# Altium schematic sheet wacky-hat.SchDoc: Wacky Hat
size A3; DrawnBy: HM, WG, TC, SC; Address1: ECE Department; Address2: University of Canterbury; Address3: Christchurch 8041; Address4: New Zealand; Revision: 1; ImagePath: \\maxwell\elecapp\AltiumDesigner\Templates\uc-logo.png
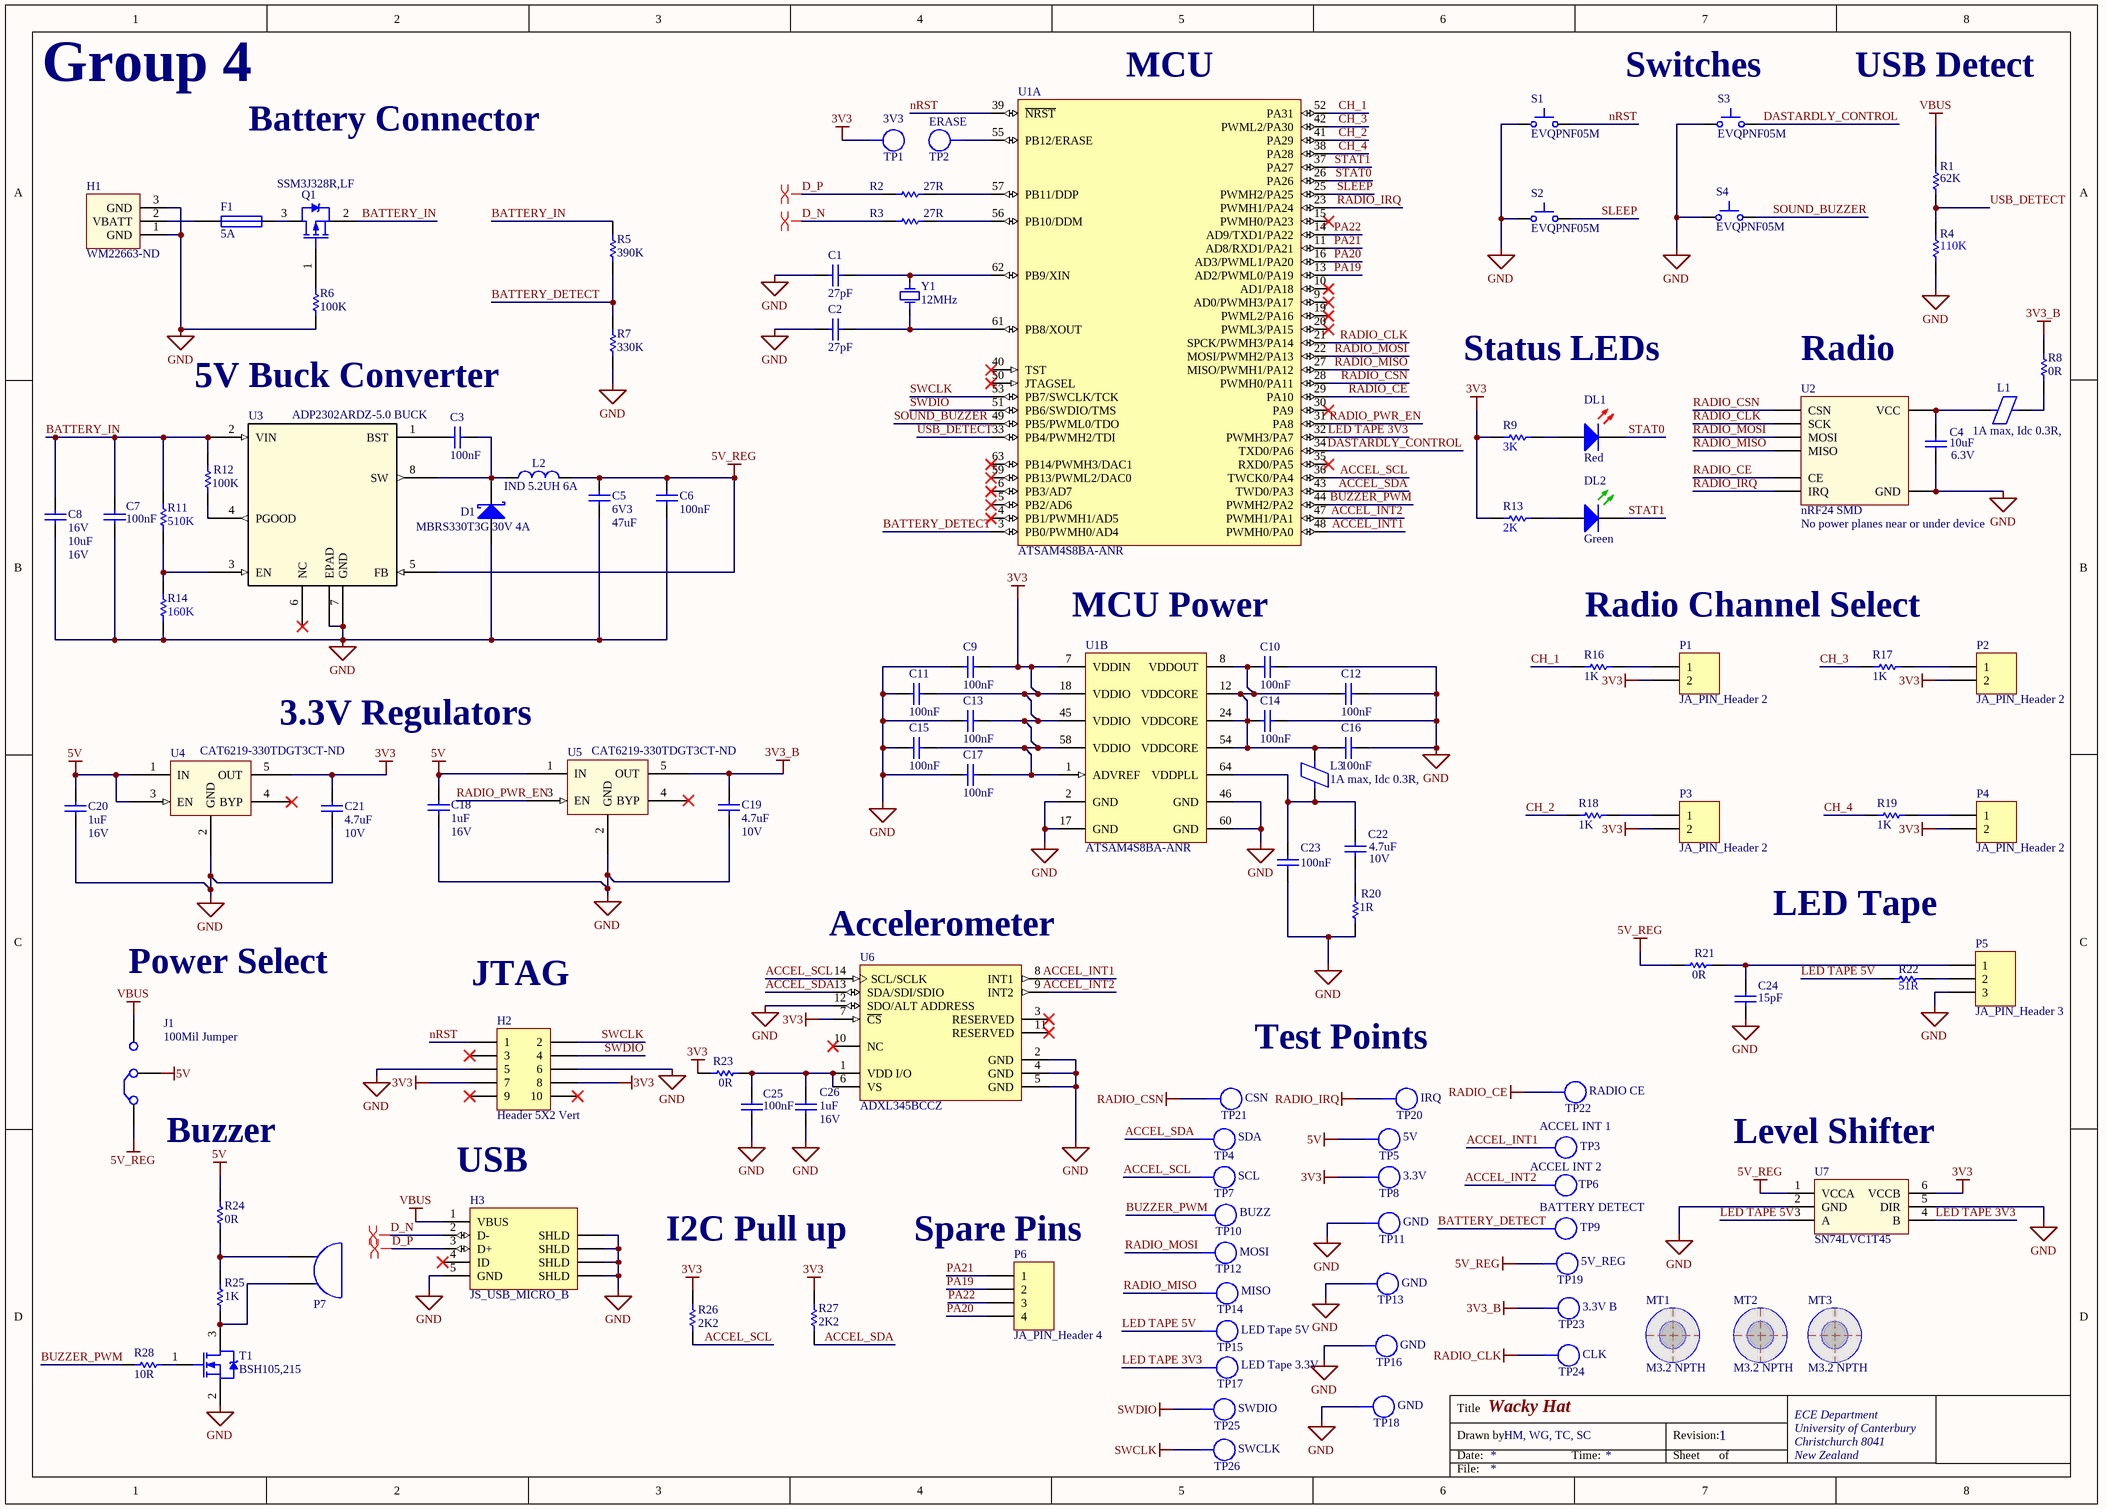
[diagram p0: wacky-hat.SchDoc]

## Parts
C1  27pF  [CAPC1608L]
C2  27pF  [CAPC1608L]
C3  100nF  [CAPC1608L]
C4  Voltage - Rated: 6.3V  [CAPC1608L]  (hidden comment: 10uF)
C5  Voltage Rating: 6V3  Capacitance: 47uF  [CAPC2012N]  (hidden comment: CC_47uF_0805_6V3)
C6  100nF  [CAPC1608L]
C7  100nF  [CAPC1608L]
C8  Voltage - Rated: 16V  [CAPC2012L]  (hidden comment: 10uF)
C9  100nF  [CAPC1608L]
C10  100nF  [CAPC1608L]
C11  100nF  [CAPC1608L]
C12  100nF  [CAPC1608L]
C13  100nF  [CAPC1608L]
C14  100nF  [CAPC1608L]
C15  100nF  [CAPC1608L]
C16  100nF  [CAPC1608L]
C17  100nF  [CAPC1608L]
C18  Max Voltage: 16V  [CAPC1608L]  (hidden comment: 1uF)
C19  Max Voltage: 10V  [CAPC1608N]  (hidden comment: 4.7uF)
C20  Max Voltage: 16V  [CAPC1608L]  (hidden comment: 1uF)
C21  Max Voltage: 10V  [CAPC1608N]  (hidden comment: 4.7uF)
C22  Max Voltage: 10V  [CAPC1608N]  (hidden comment: 4.7uF)
C23  100nF  [CAPC1608L]
C24  15pF  [CAPC1608L]
C25  100nF  [CAPC1608L]
C26  Max Voltage: 16V  [CAPC1608L]  (hidden comment: 1uF)
D1  MBRS330T3G 30V 4A  [SMC]
DL1  Red  [WL-SMCW0603]
DL2  Green  [WL-SMCW0603]
F1  5A  [RESC3216N]
H1  Supplier Part Number 1: WM22663-ND  [BATT_HEADER_3POS]  (hidden comment: Battery_HEADER_3pin)
H2  Header 5X2 Vert  [IDC2.54-V10D]
H3  JS_USB_MICRO_B  [FCI_USB_10118194-0001LF]
J1  100Mil Jumper  [JMP2.54-CO]
L1  1A max, Idc 0.3R,  [INDC3216L]
L2  IND 5.2UH 6A  [INDUCTOR5u2]
L3  1A max, Idc 0.3R,  [INDC3216L]
MT1  M3.2 NPTH  [MNT-HOLE_3.2mm_NPTH]  (no BOM)
MT2  M3.2 NPTH  [MNT-HOLE_3.2mm_NPTH]  (no BOM)
MT3  M3.2 NPTH  [MNT-HOLE_3.2mm_NPTH]  (no BOM)
P1  JA_PIN_Header 2  [HDR1X2]
P2  JA_PIN_Header 2  [HDR1X2]
P3  JA_PIN_Header 2  [HDR1X2]
P4  JA_PIN_Header 2  [HDR1X2]
P5  JA_PIN_Header 3  [HDR1X3]
P6  JA_PIN_Header 4  [HDR1X4]
P7  Piezo Buzzer  [BUZZER]  (value not drawn)
Q1  SSM3J328R,LF  [SOT23_L]
R1  62K  [RESC1608L]
R2  27R  [RESC1608L]
R3  27R  [RESC1608L]
R4  110K  [RESC1608L]
R5  390K  [RESC1608L]
R6  100K  [RESC1608L]
R7  330K  [RESC1608L]
R8  0R  [RESC1608L]
R9  3K  [RESC1608L]
R11  510K  [RESC1608L]
R12  100K  [RESC1608L]
R13  2K  [RESC1608L]
R14  160K  [RESC1608L]
R16  1K  [RESC1608L]
R17  1K  [RESC1608L]
R18  1K  [RESC1608L]
R19  1K  [RESC1608L]
R20  1R  [RESC3216L]
R21  0R  [RESC1608L]
R22  51R  [RESC1608L]
R23  0R  [RESC1608L]
R24  0R  [RESC1608L]
R25  1K  [RESC1608L]
R26  2K2  [RESC1608L]
R27  2K2  [RESC1608L]
R28  10R  [RESC1608L]
S1  EVQPNF05M  [EVQPNF05M]
S2  EVQPNF05M  [EVQPNF05M]
S3  EVQPNF05M  [EVQPNF05M]
S4  EVQPNF05M  [EVQPNF05M]
T1  BSH105,215  [SOT23_L]
TP1  3V3  [TP_1206]  (no BOM)
TP2  ERASE  [TP_1206]  (no BOM)
TP3  ACCEL INT 1  [TP_1206]  (no BOM)
TP4  SDA  [TP_1206]  (no BOM)
TP5  5V  [TP_1206]  (no BOM)
TP6  ACCEL INT 2  [TP_1206]  (no BOM)
TP7  SCL  [TP_1206]  (no BOM)
TP8  3.3V  [TP_1206]  (no BOM)
TP9  BATTERY DETECT  [TP_1206]  (no BOM)
TP10  BUZZ  [TP_1206]  (no BOM)
TP11  GND  [TP_1206]  (no BOM)
TP12  MOSI  [TP_1206]  (no BOM)
TP13  GND  [TP_1206]  (no BOM)
TP14  MISO  [TP_1206]  (no BOM)
TP15  LED Tape 5V  [TP_1206]  (no BOM)
TP16  GND  [TP_1206]  (no BOM)
TP17  LED Tape 3.3V  [TP_1206]  (no BOM)
TP18  GND  [TP_1206]  (no BOM)
TP19  5V_REG  [TP_1206]  (no BOM)
TP20  IRQ  [TP_1206]  (no BOM)
TP21  CSN  [TP_1206]  (no BOM)
TP22  RADIO CE  [TP_1206]  (no BOM)
TP23  3.3V B  [TP_1206]  (no BOM)
TP24  CLK  [TP_1206]  (no BOM)
TP25  SWDIO  [TP_1206]  (no BOM)
TP26  SWCLK  [TP_1206]  (no BOM)
U1  ATSAM4S8BA-ANR  [LQFP64_L]  (parts A,B of 2)
U2  nRF24 SMD  Warning: No power planes near or under device  [NRF24]
U3  ADP2302ARDZ-5.0 BUCK  [RD_8_1]
U4  Supplier Part Number: CAT6219-330TDGT3CT-ND  [SOT95P280X145-5N]  (hidden comment: CAT6219-330TDGT3)
U5  Supplier Part Number: CAT6219-330TDGT3CT-ND  [SOT95P280X145-5N]  (hidden comment: CAT6219-330TDGT3)
U6  ADXL345BCCZ  [ADI-CC-14-1_V]
U7  SN74LVC1T45  [SOT23-6_N]
Y1  12MHz  [6.0X3.5-4]

## Nets
3V3: C9.2 C11.2 C13.2 C15.2 C17.2 C21.2 H2.7 H2.8 P1.2 P2.2 P3.2 P4.2 R9.1 R13.1 R23.1 R26.2 R27.2 TP1.1 TP8.1 U1.1(ADVREF) U1.7(VDDIN) U1.18(VDDIO) U1.45(VDDIO) U1.58(VDDIO) U4.5(OUT) U6.7(~{CS}) U7.6(VCCB)
3V3_B: C19.2 R8.2 TP23.1 U5.5(OUT)
5V: C18.2 C20.2 J1.2(C2) R24.2 TP5.1 U4.1(IN) U4.3(EN) U5.1(IN)
5V_REG: C5.2 C6.2 J1.1(C1) L2.2 R21.1 TP19.1 U3.5(FB) U7.1(VCCA)
GND: C1.1 C2.1 C4.1 C5.1 C6.1 C7.1 C8.1 C9.1 C10.1 C11.1 C12.1 C13.1 C14.1 C15.1 C16.1 C17.1 C18.1 C19.1 C20.1 C21.1 C23.1 C24.1 C25.1 C26.1 D1.1(A) H1.1(GND) H1.3(GND) H2.5 H2.6 H3.5(GND) H3.6(SHLD) P5.3 R4.1 R6.1 R7.1 R14.1 R20.1 S1.1 S2.1 S3.1 S4.1 T1.2 TP11.1 TP13.1 TP16.1 TP18.1 U1.2(GND) U1.17(GND) U1.46(GND) U1.60(GND) U2.2(GND) U3.7(GND) U3.EPAD U4.2(GND) U5.2(GND) U6.2(GND) U6.4(GND) U6.5(GND) U6.12(SDO/ALT_ADDRESS) U7.2(GND) U7.5(DIR)
RADIO_CE: TP22.1 U1.29(PA10) U2.3(CE)
RADIO_CLK: TP24.1 U1.21(SPCK/PWMH3/PA14) U2.5(SCK)
RADIO_CSN: TP21.1 U1.28(PWMH0/PA11) U2.4(CSN)
RADIO_IRQ: TP20.1 U1.23(PWMH1/PA24) U2.8(IRQ)
SWCLK: H2.2 TP26.1 U1.53(PB7/SWCLK/TCK)
SWDIO: H2.4 TP25.1 U1.51(PB6/SWDIO/TMS)
VBUS: H3.1(VBUS) J1.3(C3) R1.2
ACCEL_INT1: TP3.1 U1.48(PWMH0/PA0) U6.8(INT1)
ACCEL_INT2: TP6.1 U1.47(PWMH1/PA1) U6.9(INT2)
ACCEL_SCL: R26.1 TP7.1 U1.36(TWCK0/PA4) U6.14(SCL/SCLK)
ACCEL_SDA: R27.1 TP4.1 U1.43(TWD0/PA3) U6.13(SDA/SDI/SDIO)
BATTERY_DETECT: R5.1 R7.2 TP9.1 U1.3(PB0/PWMH0/AD4)
BATTERY_IN: C7.2 C8.2 Q1.2 R5.2 R11.2 R12.2 U3.2(VIN)
BUZZER_PWM: R28.1 TP10.1 U1.44(PWMH2/PA2)
CH_1: R16.1 U1.52(PA31)
CH_2: R18.1 U1.41(PA29)
CH_3: R17.1 U1.42(PWML2/PA30)
CH_4: R19.1 U1.38(PA28)
D_N: H3.2(D-) R3.1
D_P: H3.3(D+) R2.1
DASTARDLY_CONTROL: S3.2 U1.34(TXD0/PA6)
LED TAPE 3V3: TP17.1 U1.32(PWMH3/PA7) U7.4(B)
LED TAPE 5V: R22.1 TP15.1 U7.3(A)
nRST: H2.1 S1.2 U1.39(~{NRST})
PA19: P6.2 U1.13(AD2/PWML0/PA19)
PA20: P6.4 U1.16(AD3/PWML1/PA20)
PA21: P6.1 U1.11(AD8/RXD1/PA21)
PA22: P6.3 U1.14(AD9/TXD1/PA22)
RADIO_MISO: TP14.1 U1.27(MISO/PWMH1/PA12) U2.7(MISO)
RADIO_MOSI: TP12.1 U1.22(MOSI/PWMH2/PA13) U2.6(MOSI)
RADIO_PWR_EN: U1.31(PA8) U5.3(EN)
SLEEP: S2.2 U1.25(PWMH2/PA25)
SOUND_BUZZER: S4.2 U1.49(PB5/PWML0/TDO)
STAT0: DL1.1(K) U1.26(PA26)
STAT1: DL2.1(K) U1.37(PA27)
USB_DETECT: R1.1 R4.2 U1.33(PB4/PWMH2/TDI)
NetC1_2: C1.2 U1.62(PB9/XIN) Y1.3(OSC2)
NetC2_2: C2.2 U1.61(PB8/XOUT) Y1.1(OSC1)
NetC3_1: C3.1 U3.1(BST)
NetC3_2: C3.2 D1.2(K) L2.1 U3.8(SW)
NetC4_2: C4.2 L1.1 U2.1(VCC)
NetC10_2: C10.2 C12.2 C14.2 C16.2 L3.2 U1.8(VDDOUT) U1.12(VDDCORE) U1.24(VDDCORE) U1.54(VDDCORE)
NetC22_1: C22.1 C23.2 L3.1 U1.64(VDDPLL)
NetC22_2: C22.2 R20.2
NetC24_2: C24.2 P5.1 R21.2
NetC25_2: C25.2 C26.2 R23.2 U6.1(VDD_I/O) U6.6(VS)
NetDL1_2: DL1.2(A) R9.2
NetDL2_2: DL2.2(A) R13.2
NetF1_1: F1.1 H1.2(VBATT)
NetF1_2: F1.2 Q1.3
NetL1_2: L1.2 R8.1
NetP1_1: P1.1 R16.2
NetP2_1: P2.1 R17.2
NetP3_1: P3.1 R18.2
NetP4_1: P4.1 R19.2
NetP5_2: P5.2 R22.2
NetP7_1: P7.1 R24.1 R25.2
NetP7_2: P7.2 R25.1 T1.3
NetQ1_1: Q1.1 R6.2
NetR2_2: R2.2 U1.57(PB11/DDP)
NetR3_2: R3.2 U1.56(PB10/DDM)
NetR11_1: R11.1 R14.2 U3.3(EN)
NetR12_1: R12.1 U3.4(PGOOD)
NetR28_2: R28.2 T1.1
NetTP2_1: TP2.1 U1.55(PB12/ERASE)

Not connected (* = marked no-connect by the designer): H2 3* 9* 10*; H3 4(ID)*; U1 4(PB1/PWMH1/AD5)* 5(PB2/AD6)* 6(PB3/AD7)* 9(AD0/PWMH3/PA17)* 10(AD1/PA18)* 15(PWMH0/PA23)* 19(PWML2/PA16)* 20(PWML3/PA15)* 30(PA9)* 35(RXD0/PA5)* 40(TST)* 50(JTAGSEL)* 59(PB13/PWML2/DAC0)* 63(PB14/PWMH3/DAC1)*; U3 6(NC)*; U4 4(BYP)*; U5 4(BYP)*; U6 3(RESERVED)* 10(NC)* 11(RESERVED)*

## Layout directives
differential pair; differential pair class D_N: D_N
differential pair; differential pair class D_P: D_P

## Notes on the sheet
- Group 4
- (near U1) MCU
- (near S3) Switches
- USB Detect
- Battery Connector
- Status LEDs
- (near U2) Radio
- 5V Buck Converter
- MCU Power
- Radio Channel Select
- 3.3V Regulators
- LED Tape
- (near J1) Power Select
- (near H2) JTAG
- (near U6) Accelerometer
- Test Points
- (near J1) Buzzer
- USB
- (near U7) Level Shifter
- I2C Pull up
- (near P6) Spare Pins
- Title
- Drawn by:
- Date:
- Time:
- Revision:
- Sheet
- of
- File:

## Library data of the parts
C1 C2 = CC_27pF_0603: CAP CER 27pF NPO/COG +-5% 50V 0603; PackageReference: 0603; Code_IPC: 1608 [0603]; Verify: *; Supplier: ECE Dept; Storage Location: PCB Assembly WS; Value: 27pF
C3 C6 C7 C9-C17 C23 C25 = CC_100nF_0603: CAP CER 100nF X7R +-10% 50V 0603; PackageReference: 0603; Code_IPC: 1608 [0603]; Verify: *; Supplier: ECE Dept; Storage Location: PCB Assembly WS; Value: 100nF
C4 = CC_10uF_0603: CAP CER 10UF X5R +-20% 6V3 0603; Supplier: ECE Dept; Storage Location: PCB Assembly WS; Value: 10uF
C5 = CC_47uF_0805_6V3: SAMSUNG ELECTRO-MECHANICS - CL21A476MQCLRNC - CAP, 47UF, 6.3V, MLCC, 0805; Tolerance: 20%; Dielectric: X5R; Supplier 1: Digi-Key; Manufacturer 1: Samsung; Manufacturer Part Number 1: CL21A476MQCLRNC; Stock 1: 94580; Pricing 1: 1=0.56000, 10=0.39100, 50=0.27380, 100=0.23470, 500=0.17602, 1000=0.14865 (USD); RoHS: Yes; Mount: Surface Mount; Case/Package: 0805; Case Code (Metric): 2012; Case Code (Imperial): 0805; Contact Plating: Tin; Min Operating Temperature: -55°C; Max Operating Temperature: 85°C; Packaging: Tape and Reel; Package Quantity: 4000; Termination: Wraparound; Series: CL; Construction: Flat; Length: 2mm; Width: 0.049inch; Thickness: 0.037inch; Depth: 1.25mm; Lead Free: Lead Free; RoHS Compliant: Yes; ComponentLink1URL: https://datasheet.ciiva.com/25723/cl21a476mqclrnc-25723991.pdf?src-supplier=Digi-Key; ComponentLink1Description: https://datasheet.ciiva.com/25723/cl21a476mqclrnc-25723991.pdf?src-supplier=Digi-Key; Supplier Part Number 1: 1276-2420-1-ND
C8 = CC_10uF_0805_16V: CAP CER 10uF X5R 16V 0805; Manufacturer: Samsung Electro-Mechanics; Manufacturer Part Number: CL21A106KOQNNWE; Note: Footprint corresponds to dimensions for bulk cassette packaging. This case size has tightened tolerances.; Tolerance: ±10%; Notification: Current market demand for these product types have resulted in fluctuating and extending lead times. Lead times may differ.; PackageReference: 0805; Code_IPC: 2012[0805]; Supplier 1: Digi-Key; RoHS: RoHS Compliant; Category: Capacitors; Stock 1: 20000; Pricing 1: 1=0.35, 10=0.25, 100=0.1178, 500=0.08254, 1000=0.06831 (NZD); Packaging: Cut Tape (CT); Part Status: Active; Temperature Coefficient: X5R; Operating Temperature: -55°C ~ 85°C; Features: -; Ratings: -; Applications: General Purpose; Mounting Type: Surface Mount, MLCC; Package / Case: 0805 (2012 Metric); Size / Dimension: 0.079" L x 0.049" W (2.00mm x 1.25mm); Height - Seated (Max): -; Thickness (Max): 0.055" (1.40mm); Lead Spacing: -; Lead Style: -; ComponentLink1URL: http://www.samsungsem.com/kr/support/product-search/mlcc/CL21A106KOQNNWE.jsp; ComponentLink1Description: http://www.samsungsem.com/kr/support/product-search/mlcc/CL21A106KOQNNWE.jsp; Supplier Part Number 1: 1276-2894-1-ND; Value: 10uF; Max Voltage: 16V
C18 C20 C26 = CC_1uF_0603: CAP CER 1uF Y5V -20% +80% 16V 0603; PackageReference: 0603; Code_IPC: 1608 [0603]; Verify: *; Supplier: ECE Dept; Storage Location: PCB Assembly WS; Value: 1uF
C19 C21 C22 = CC_4.7uF_0603: CAP CER 4.7uF X5R +-20%  10V 0603; Note: Footprint corresponds to dimensions for bulk cassette packaging. This case size has tightened tolerances.; PackageReference: 0805; Code_IPC: 2012[0805]; Verify: *; Supplier: ECE Dept; Storage Location: PCB Assembly WS; Value: 4.7uF
C24 = CC_15pF_0603: CAP CER 15pF NPO/COG +-5% 50V 0603; PackageReference: 0603; Code_IPC: 1608 [0603]; Verify: *; Supplier: ECE Dept; Storage Location: PCB Assembly WS; Value: 15pF
D1 = MBRS330T3G: SCHOTTKY  30V 4A; Manufacturer: ON Semiconductor; Speed: Fast Recovery =< 500ns, > 200mA (Io); Supplier 1: Digi-Key; Manufacturer Part Number: MBRS330T3G; RoHS: RoHS Compliant; Category: Discrete Semiconductor Products; Stock 1: 8919; Pricing 1: 1=0.93, 10=0.79, 100=0.5902, 500=0.46368, 1000=0.35829 (NZD); Packaging: Cut Tape (CT); Part Status: Active; Diode Type: Schottky; Current - Average Rectified (Io): 4A; Capacitance @ Vr, F: -; Mounting Type: Surface Mount; Package / Case: DO-214AB, SMC; Supplier Device Package: SMC; Operating Temperature - Junction: -65°C ~ 150°C; Base Part Number: MBRS330; ComponentLink1URL: http://www.onsemi.com/pub/Collateral/MBRS340T3-D.PDF; ComponentLink1Description: http://www.onsemi.com/pub/Collateral/MBRS340T3-D.PDF; Supplier Part Number 1: MBRS330T3GOSCT-ND
DL1 = DL_150060RS75000: LED Red 250mcd 0603 SMD; Manufacturer: WURTH ELEKTRONIK; Forward Current If: 30; Forward Voltage: 2; Lens Shape: Rectangular; Luminous Intensity: 250; Wavelength Typ: 625; Viewing Angle: 140°; LED Mounting: SMD; Supplier 1: Farnell; Supplier Part Number 1: 2322071; Manufacturer Part Number: 150060RS75000; Storage Location: PCB Assembly WS; Supplier: ECE Dept; LED Colour: Red
DL2 = DL_150060GS75000: LED Green 430mcd 0603 SMD; Manufacturer: WURTH ELEKTRONIK; Forward Current If: 30; Wavelength Typ: 520; Forward Voltage: 3.2; Lens Shape: Rectangular; Luminous Intensity: 430; Viewing Angle: 140°; LED Mounting: SMD; Supplier 1: Farnell; Supplier Part Number 1: 2322070; Manufacturer Part Number: 150060GS75000; Storage Location: PCB Assembly WS; Supplier: ECE Dept; LED Colour: Green
F1 = FS_Fuse_5.0A: Fuse 5.0A Fast Acting 1206 SMD; Manufacturer Part Number: C1F5; Manufacturer: Bel TRP; Voltage Rating (AC): 125V; Voltage Rating (DC): 63V; DC Cold Resistance: 19mR; Fuse Type: Board Mount (Cartridge Style Excluded); Approvals: CE,cURus; Mount: Surface Mount; Case/Package: 1206; Number of Pins: 2; Case Code (Metric): 3216; Case Code (Imperial): 1206; Contact Plating: Nickel,Tin; Min Operating Temperature: -55°C; Max Operating Temperature: 125°C; Packaging: Tape and Reel; Voltage Rating: 125V; Length: 0.126inch; Width: 0.062inch; Supplier 1: Digi-Key; Stock 1: 725; Pricing 1: 1=0.32, 5=0.312, 10=0.298, 50=0.2662, 100=0.2479, 250=0.22032, 500=0.1836, 1000=0.17442 (USD); ComponentLink1URL: http://www.farnell.com/datasheets/2571625.pdf; ComponentLink1Description: http://www.farnell.com/datasheets/2571625.pdf; ComponentLink2URL: http://belfuse.com/pdfs/C1F.pdf; ComponentLink2Description: http://belfuse.com/pdfs/C1F.pdf; ComponentLink3URL: http://www.mouser.com/ds/2/643/C1F-594910.pdf; ComponentLink3Description: http://www.mouser.com/ds/2/643/C1F-594910.pdf; ComponentLink4URL: https://belfuse.com/resources/StewartConnector/C1F.pdf; ComponentLink4Description: https://belfuse.com/resources/StewartConnector/C1F.pdf; Current Rating: 5A; Supplier Part Number 1: 507-1886-1-ND; Supplier 2: Element14; Supplier Part Number 2: 2848595; Value: 5A
H1 = Battery_HEADER_3pin: 3Pin Header 2.54mm spacing / Digikey #WM22663-ND; Supplier 1: Digi-Key
H2 = JA_HDR_IDC_5X2_VERT: IDC Header, 2,54mm, 10-Pin, Vert; Supplier: ECE Dept; Supplier 1: Farnell; Supplier Part Number 1: 1096985; Storage Location: ECE Dept Store
H3 = JS_USB_MICRO_B_SMT: CONN USB MICRO B RECPT SMT R/A; Manufacturer: FCI; Manufacturer Part Number: 10118194-0001LF; Gender: Receptacle; Number of Contacts: 5; Specifications: USB 2.0; Supplier 1: Digi-Key; Supplier Part Number 1: 609-4618-1-ND; Features: Shielded, Solder Retention; Mounting Type: Surface Mount, Right Angle, Horizontal
J1 = TP_JUMPER_CO: 2.54mm Jumper change over, Thru Hole; Supplier: ECE Dept; Storage Location: ECE$ Store
L1 L3 = IN_Ferrite-Bead: Ferrite Bead, Rdc 0.3R, Z100MHZ 600R, Imax 1A, SMD 1206; Manufacturer: FAIR-RITE; Manufacturer PN: 2512066017Y1; DC Current Rating: 1; DC Resistance Max: 0.08; Ferrite Case Style: 1206 ^3216 Metric]; Frequency Range: 50MHz to 1; Impedance: 600; Impedance Tolerance: ± 25%; Supplier: ECE Dept; Storage Location: PCB Assembly WS; Ferrite Mounting: SMD; Supplier 1: Farnell; Supplier Part Number 1: 1612060; Manufacturer Part Number: 2512066017Y1; Value: 1A max, Idc 0.3R,
L2 = CDRH104RNP-5R2NC: FIXED IND 5.2UH 6A 22 MOHM SMD; Manufacturer: Sumida America Components Inc.; Material - Core: Ferrite; Tolerance: ±30%; Current - Saturation: 5.6A; Shielding: Shielded; DC Resistance (DCR): 22 mOhm Max; Supplier 1: Digi-Key; Manufacturer Part Number: CDRH104RNP-5R2NC; RoHS: RoHS Compliant; Category: Inductors, Coils, Chokes; Stock 1: 3849; Pricing 1: 1=2.9, 10=2.678, 100=1.8743, 500=1.5173 (NZD); Packaging: Cut Tape (CT); Part Status: Active; Type: -; Q @ Freq: -; Frequency - Self Resonant: -; Ratings: -; Operating Temperature: -40°C ~ 100°C; Mounting Type: Surface Mount; Package / Case: Nonstandard; Supplier Device Package: -; Size / Dimension: 0.402" L x 0.394" W (10.20mm x 10.00mm); Height - Seated (Max): 0.157" (4.00mm); ComponentLink1URL: http://products.sumida.com/products/pdf/CDRH104R.pdf; ComponentLink1Description: http://products.sumida.com/products/pdf/CDRH104R.pdf; Supplier Part Number 1: 308-2280-1-ND
MT1-MT3 = MC_M3.2_HOLE: Fixing M3.2 Mount Hole NPTH; Manufacturer: Hi-Q; Manufacturer PN: 3BV series M3 Clearance; price: 0; Supplier: ECE Dept; value: M3.2 NPTH
P1-P4 = JA_PIN_Header 2: Header, 2-Pin; LatestRevisionDate: 17-Jul-2002; LatestRevisionNote: Re-released for DXP Platform.; Publisher: Altium Limited
P5 = JA_PIN_Header 3: Header, 3-Pin; LatestRevisionDate: 17-Jul-2002; LatestRevisionNote: Re-released for DXP Platform.; Publisher: Altium Limited
P6 = JA_PIN_Header 4: Header, 4-Pin; LatestRevisionDate: 17-Jul-2002; LatestRevisionNote: Re-released for DXP Platform.; Publisher: Altium Limited
P7 = Piezo Buzzer: TDK - PS1240P02BT - BUZZER, PIEZO, 70DB, 12.2MM; Number of Terminals/Pins: 2; Frequency: 4kHz; Operating Supply Voltage: 3V; Washable: No; Supplier 1: Digi-Key; Manufacturer 1: TDK; Manufacturer Part Number 1: PS1240P02BT; Stock 1: 24025; Pricing 1: 1=0.61000, 10=0.52500, 25=0.49120, 50=0.46580, 100=0.44110 (USD); RoHS: Yes; Mount: Through Hole; Number of Pins: 2; Min Operating Temperature: -10°C; Max Operating Temperature: 70°C; Package Quantity: 1; Packaging: Tape and Reel; Termination: PC Pins; Voltage Rating (DC): 3V; Series: PS; Diameter: 12.2mm; Height: 6.5mm; Lead Free: Lead Free; RoHS Compliant: Yes; ComponentLink1URL: https://datasheet.ciiva.com/0/ef532-ps-112.pdf?src-supplier=Digi-Key; ComponentLink1Description: https://datasheet.ciiva.com/0/ef532-ps-112.pdf?src-supplier=Digi-Key; ComponentLink2URL: https://datasheet.ciiva.com/0/ef532-ps-111.pdf?src-supplier=Digi-Key; ComponentLink2Description: https://datasheet.ciiva.com/0/ef532-ps-111.pdf?src-supplier=Digi-Key; ComponentLink3URL: https://datasheet.ciiva.com/3306/ef532-ps-3306958.pdf?src-supplier=Avnet; ComponentLink3Description: https://datasheet.ciiva.com/3306/ef532-ps-3306958.pdf?src-supplier=Avnet; ComponentLink4URL: https://datasheet.ciiva.com/16225/ef532-ps-16225062.pdf?src-supplier=Onlinecomponents.com; ComponentLink4Description: https://datasheet.ciiva.com/16225/ef532-ps-16225062.pdf?src-supplier=Onlinecomponents.com; Supplier Part Number 1: 445-2525-1-ND
Q1 = TM_SSM3J328R: MOSFET P-CH 20V 6A SOT23-3; Manufacturer: Toshiba; FET Feature: Logic Level Gate, 1.5V Drive; FET Type: MOSFET P-Channel, Metal Oxide; Gate Charge (Qg) @ Vgs: 12.8nC @ 4.5V; Input Capacitance (Ciss) @ Vds: 840pF @ 10V; Power - Max: 1W; Rds On Max: 29.8mR; Drain to Source Resistance: 47.4mR; Turn-On Delay Time: 32ns; Power Dissipation: 2W; Number of Channels: 1; Turn-Off Delay Time: 107ns; Gate to Source Voltage (Vgs): 8V; Input Capacitance: 840pF; Element Configuration: Single; Drain to Source Breakdown Voltage: -20V; Vgs(th) (Max) @ Id: 1V @ 1mA; Current - Continuous Drain (Id) @ 25° C: 6A; Drain to Source Voltage (Vdss): 20V; Package / Case: SOT-23-3 Flat Leads; Supplier Device Package: SOT-23F; Pricing: 1=0.79, 10=0.658, 25=0.5772, 100=0.4939, 250=0.42836, 500=0.36284, 1000=0.27972 (NZD); Storage Location: PCB Assembly WS; Supplier: Digi-Key; ComponentLink1URL: https://datasheet.ciiva.com/11158/ssm3j328r-datasheet-en-20140301-11158652.pdf; ComponentLink1Description: https://datasheet.ciiva.com/11158/ssm3j328r-datasheet-en-20140301-11158652.pdf; Supplier Part Number: SSM3J328RLFDKR-ND; Max Operating Temperature: 150°C; Mount: Surface Mount; Packaging: Tape and Reel; Min Operating Temperature: -55°C; Continuous Drain Current (ID): 6A; Radiation Hardening: No; Max Power Dissipation: 1W; Package Quantity: 3000; Case/Package: SOT-23-3; Number of Pins: 3; Number of Elements: 1; Supplier 1: Digi-Key; Supplier Part Number 1: SSM3J328RLFDKR-ND; Manufacturer Part Number: SSM3J328R,LF
R1 = RS_62K: RES 62.0K OHM 1/10W 5% 0603 SMD; Storage Location: PCB Assembly WS; Supplier: ECE Dept; Value: 62K
R2 R3 = RS_27R: RES 27 OHM 1/10W 5% 0603 SMD; Storage Location: PCB Assembly WS; Supplier: ECE Dept; Value: 27R
R4 = RS_110K: RES 110K OHM 1/10W 5% 0603 SMD; Storage Location: PCB Assembly WS; Supplier: ECE Dept; Value: 110K
R5 = RS_390K: RES 390K OHM 1/10W 5% 0603 SMD; Storage Location: PCB Assembly WS; Supplier: ECE Dept; Value: 390K
R6 R12 = RS_100K: RES 100K OHM 1/10W 5% 0603 SMD; Storage Location: PCB Assembly WS; Supplier: ECE Dept; Value: 100K
R7 = RS_330K: RES 330K OHM 1/10W 5% 0603 SMD; Storage Location: PCB Assembly WS; Supplier: ECE Dept; Value: 330K
R8 R21 R23 R24 = RS_0R0: RES 0.0 OHM 1/10W 5% 0603 SMD; Storage Location: PCB Assembly WS; Supplier: ECE Dept; Value: 0R
R9 = RS_3K: RES 3K OHM 1/10W 5% 0603 SMD; Storage Location: PCB Assembly WS; Supplier: ECE Dept; Value: 3K
R11 = RS_510K: RES 510K OHM 1/10W 5% 0603 SMD; Storage Location: PCB Assembly WS; Supplier: ECE Dept; Value: 510K
R13 = RS_2K: RES 2K OHM 1/10W 5% 0603 SMD; Storage Location: PCB Assembly WS; Supplier: ECE Dept; Value: 2K
R14 = RS_160K: RES 160K OHM 1/10W 5% 0603 SMD; Storage Location: PCB Assembly WS; Supplier: ECE Dept; Value: 160K
R16-R19 R25 = RS_1K: RES 1.0K OHM 1/10W 5% 0603 SMD; Storage Location: PCB Assembly WS; Supplier: ECE Dept; Value: 1K
R20 = RT_1R: RES 1R OHM 1/4W 5% 1206 SMD; Storage Location: PCB Assembly WS; Supplier: ECE Dept; Value: 1R
R22 = RS_51R: RES 51 OHM 1/10W 5% 0603 SMD; Storage Location: PCB Assembly WS; Supplier: ECE Dept; Value: 51R
R26 R27 = RS_2K2: RES 2.2K OHM 1/10W 5% 0603 SMD; Storage Location: PCB Assembly WS; Supplier: ECE Dept; Value: 2K2
R28 = RS_10R: RES 10 OHM 1/10W 5% 0603 SMD; Storage Location: PCB Assembly WS; Supplier: ECE Dept; Value: 10R
S1-S4 = WS_EVQPNF05M: Panasonic 6 x 3.5mm SMD Light Touch Switch Type SMD; PackageDescription: 6.0 x 3.5 mm; Supplier 1: Farnell; Supplier Part Number 1: 2079481; Manufacturer: Panasonic; Manufacturer PN: EVQPNF05M; Supplier 2: Digi-Key; Supplier Part Number 2: P13598SCT-ND; Storage Location: PCB Assembly WS; Supplier: ECE Dept
T1 = TM_BSH105: MOSFET N-CH 20V 1.05A SOT-23; Manufacturer: NXP Semiconductors; FET Type: MOSFET N-Channel, Metal Oxide; Gate Charge (Qg) @ Vgs: 3.9nC @ 4.5V; Input Capacitance (Ciss) @ Vds: 152pF @ 16V; Power - Max: 417mW; Rds On (Max) @ Id, Vgs: 200 mOhm @ 600mA, 4.5V; Supplier 1: Farnell; Supplier 2: Digi-Key; Current - Continuous Drain (Id) @ 25° C: 1.05A; Drain to Source Voltage (Vdss): 20V; Package / Case: TO-236-3, SC-59, SOT-23-3; Pricing: 1=0.53, 10=0.42, 25=0.3544, 100=0.2885, 250=0.23896, 500=0.1974, 1000=0.14785 (NZD); Supplier Part Number 1: 1758066; Supplier Part Number 2: 568-6215-1-ND; Storage Location: PCB Assembly WS; Supplier: ECE Dept; Manufacturer Part Number: BSH105,215
TP1-TP26 = TP_1206: Test-Point 3.3x1.6x2.1mm SMD; Manufacturer: Harwin Inc; Manufacturer Part Number: S1751-46R; Value: TP; Manufacturer PN: *; Storage Location: ProtoPlace; Mounting Type: Surface Mount; Type: PC Test Point; Supplier 1: Digi-Key; Supplier Part Number 1: 952-1478-2-ND; Supplier 2: Farnell; Supplier Part Number 2: 1826282; Supplier: ECE Dept
U1 = SE_ATSAM4S16BA-MU: IC MCU 32BIT 512KB FLASH 64LQFP; Manufacturer: Atmel; Connectivity: I²C, IrDA, Memory Card, SPI, SSC, UART/USART, USB; Core Processor: ARM® Cortex®-M4; Core Size: 32-Bit; Data Converters: A/D 11x12b, D/A 2x12b; Number of I/O: 47; Peripherals: Brown-out Detect/Reset, DMA, POR, PWM, WDT; Program Memory Size: 512KB (512K x 8); RAM Size: 128K x 8; Speed: 120MHz; Voltage - Supply (Vcc/Vdd): 1.62 V ~ 3.6 V; PackageVersion: revJ, Jul-2007; PackageReference: 64PS; PackageDescription: 64-Pin Quad Flat No-Lead (QFN) Sawn, 9 x 9 x 1.0 mm Body, 0.5 mm Pitch, Exposed Pad; Code_JEDEC: MO-220VMMD-3; ComponentLink1Description: Manufacturer URL; ComponentLink1URL: http://www.atmel.com/; ComponentLink2Description: SAM4S Series Datasheet; ComponentLink2URL: http://www.atmel.com/dyn/resources/prod_documents/11100.pdf; ComponentLink3Description: SAM4S Series Summary; ComponentLink3URL: http://www.atmel.com/dyn/resources/prod_documents/11100S.pdf; Supplier 1: Digi-Key; Package / Case: 64-LQFP; Packaging: Cut Tape (CT); Program Memory Type: FLASH; Supplier Part Number 1: ATSAM4S8BA-ANRCT-ND; Manufacturer Part Number: ATSAM4S8BA-ANR
U2 = NRF24: nRF24 SMD Module
U3 = ADP2302ARDZ-5.0-R7: IC REG BUCK 5V 2A 8SOIC; Vendor: Analog Devices Inc; Frequency - Switching: 700kHz; Output Type: Fixed; Voltage - Input (Max): 20V; Manufacturer_Part_Number: ADP2302ARDZ-5.0-R7; Type: DEV; Value: Value; Supplier 1: Digi-Key; Current - Output: 2A; Voltage - Output (Min/Fixed): 5V; Supplier Part Number 1: ADP2302ARDZ-5.0-R7CT-ND; ComponentLink1Description: ADP2302ARDZ-5.0 Datasheet; ComponentLink1URL: \\maxwell\elecapp\AltiumDesigner\Libraries\DatasheetsNew\ENCE461\ADP2302_2303.pdf
U4 U5 = SV_CAT6219-330TDGT3: IC REG LIN 3.3V 500MA TSOT23-5; Voltage - Input (Max): 5.5V; Voltage Dropout (Max): 0.5V @ 500mA; Manufacturer Part Number: CAT6219-330TDGT3; Base Part Number: CAT6219; Current - Output: 500mA; Package / Case: SOT-23-5 Thin, TSOT-23-5; Supplier: Digi-Key; Supplier Device Package: TSOT-23-5; Voltage - Output (Min/Fixed): 3.3V; ComponentLink1URL: http://www.onsemi.com/pub/Collateral/CAT6219-D.PDF; ComponentLink1Description: http://www.onsemi.com/pub/Collateral/CAT6219-D.PDF; Supplier 1: Digi-Key; ComponentLink2Description: CAT6219 Datasheet; ComponentLink2URL: \\maxwell\elecapp\AltiumDesigner\Libraries\DatasheetsNew\ENCE461\CAT6219-D.PDF
U6 = ADXL345BCCZ: Accelerometer 3-Axis, +/-2 g / +/-4 g / +/-8 g / +/-16 g with Digital Output, 1.6 KHz BW, Industrial, 14-pin LGA, Tray; Manufacturer: Analog Devices; Sensitivity: 256/128/64/32 LSB/g; Voltage Supply (V): 2.0 to 3.6; Supply Current: 140 uA; # of Axes: 3; -3dB Bandwidth: 1.6 KHz; PackageReference: CC-14-1; ComponentLink1Description: Manufacturer URL; Packing: Tray; ComponentLink4URL: http://www.analog.com/en/mems-sensors/mems-inertial-sensors/adxl345/products/product.html; ComponentLink2URL: http://www.analog.com/static/imported-files/data_sheets/ADXL345.pdf; Mounting Technology: Surface Mount; ComponentLink3URL: http://www.analog.com/static/imported-files/data_sheets/ADXL343.pdf; PartNumber: ADXL345BCCZ; ComponentLink4Description: Product URL; Output Type: Digital; ComponentLink3Description: Package Specification; DatasheetVersion: Rev. D; PackageVersion: 03-16-2010-A, 03/2010; ComponentLink1URL: http://www.analog.com/en/index.html; ComponentLink2Description: Datasheet; PackageDescription: 14-Pin Land Grid Array, 3 x 5 mm Body, 0.8 mm Pitch; Manufacturer 1: Analog Devices; Manufacturer Part Number 1: ADXL345BCCZ
U7 = SN74LVC1T45: 1.8V - 5V level converter
Y1 = XT_CRYSTAL_12MHz_18pF: CRYSTAL 12MHZ 18PF 6X3.5mm SMD; Manufacturer: CTS-Frequency Controls; Manufacturer Part Number: 406C35D12M00000; ESR (Equivalent Series Resistance): 60 Ohm; Frequency Stability: ±50ppm; Frequency Tolerance: ±30ppm; Operating Mode: Fundamental; Supplier 1: Digi-Key; Height: 0.047" (1.20mm); Load Capacitance: 18pF; Mounting Type: Surface Mount; Operating Temperature: -20°C ~ 70°C; Package / Case: 4-SMD, No Lead (DFN, LCC); Size / Dimension: 0.236" L x 0.138" W (6.00mm x 3.50mm); Supplier Part Number 1: CTX855CT-ND; Frequency: 12MHz